# EAGLE schematic v2 Sandwich 8 bit waves (EAGLE 9.0.0)
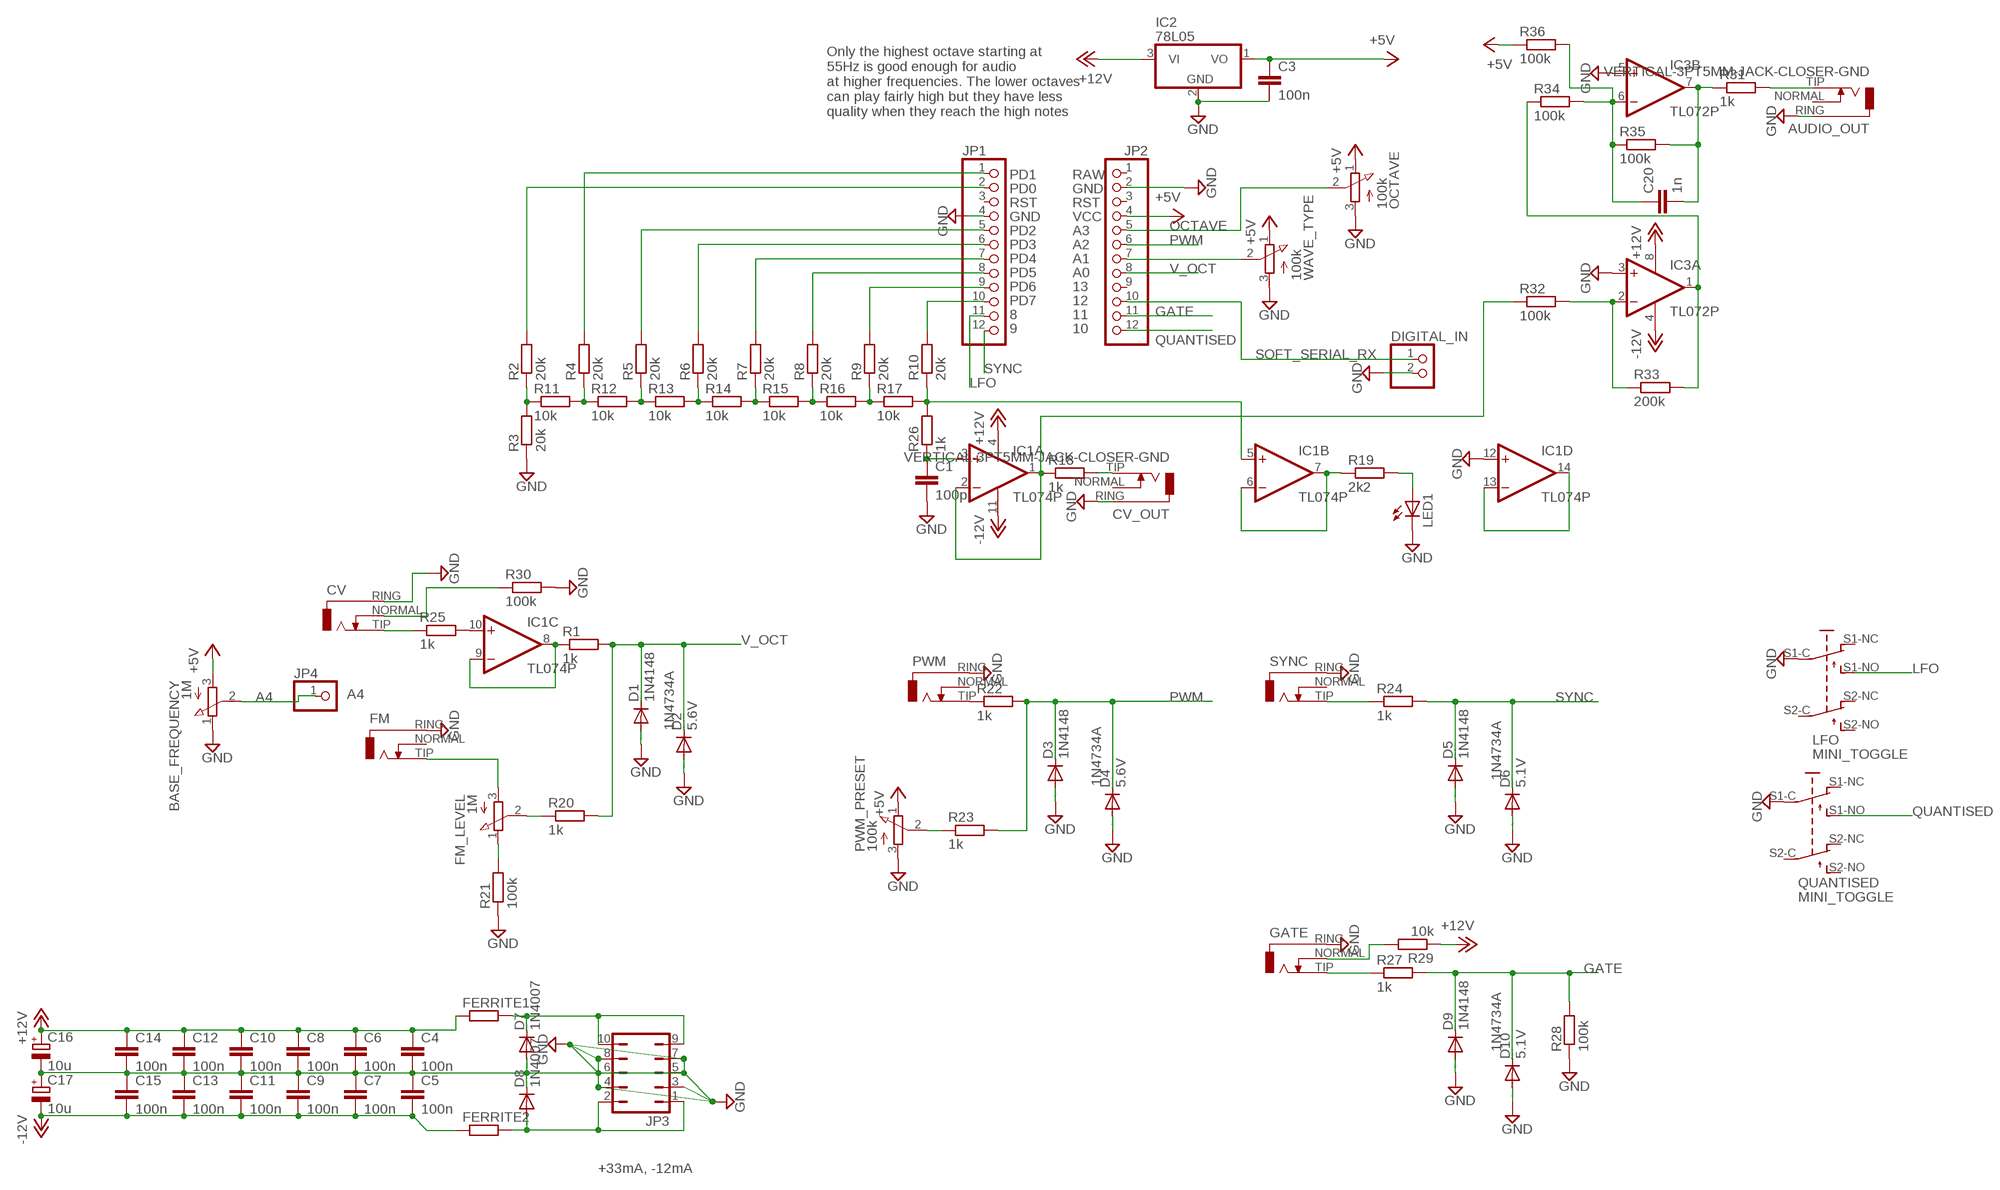
[diagram p0: schematic, sheet 1]

## Parts
AUDIO_OUT  VERTICAL-3PT5MM-JACK-CLOSER-GND  [VERTICAL-3PT5MM-JACK-CLOSER-GND]
BASE_FREQUENCY  1M  9MM_VERT_POT  [EVUF]
C1  100p  C-EU050-024X044  [C050-024X044]
C3  100n  C-EU050-024X044  [C050-024X044]
C4  100n  C-EU050-024X044  [C050-024X044]
C5  100n  C-EU050-024X044  [C050-024X044]
C6  100n  C-EU050-024X044  [C050-024X044]
C7  100n  C-EU050-024X044  [C050-024X044]
C8  100n  C-EU050-024X044  [C050-024X044]
C9  100n  C-EU050-024X044  [C050-024X044]
C10  100n  C-EU050-024X044  [C050-024X044]
C11  100n  C-EU050-024X044  [C050-024X044]
C12  100n  C-EU050-024X044  [C050-024X044]
C13  100n  C-EU050-024X044  [C050-024X044]
C14  100n  C-EU050-024X044  [C050-024X044]
C15  100n  C-EU050-024X044  [C050-024X044]
C16  10u  CPOL-EUE2.5-5  [E2,5-5]
C17  10u  CPOL-EUE2.5-5  [E2,5-5]
C20  1n  C-EU050-024X044  [C050-024X044]
CV  VERTICAL-3PT5MM-JACK-CLOSER-GND  [VERTICAL-3PT5MM-JACK-CLOSER-GND]
CV_OUT  VERTICAL-3PT5MM-JACK-CLOSER-GND  [VERTICAL-3PT5MM-JACK-CLOSER-GND]
D1  1N4148  1N914  [D-6.35]
D2  5.6V  1N4004  [DO41-10]
D3  1N4148  1N914  [D-6.35]
D4  5.6V  1N4004  [DO41-10]
D5  1N4148  1N914  [D-6.35]
D6  5.1V  1N4004  [DO41-10]
D7  1N4007  1N4004  [DO41-10]
D8  1N4007  1N4004  [DO41-10]
D9  1N4148  1N914  [D-6.35]
D10  5.1V  1N4004  [DO41-10]
DIGITAL_IN  PINHD-1X2  [1X02]
FERRITE1  R-EU_0204/7  [0204/7]
FERRITE2  R-EU_0204/7  [0204/7]
FM  VERTICAL-3PT5MM-JACK-CLOSER-GND  [VERTICAL-3PT5MM-JACK-CLOSER-GND]
FM_LEVEL  1M  9MM_VERT_POT  [EVUF]
GATE  VERTICAL-3PT5MM-JACK-CLOSER-GND  [VERTICAL-3PT5MM-JACK-CLOSER-GND]
IC1  TL074P  [DIL14]
IC2  78L05  78L05Z  [TO92]
IC3  TL072P  [DIL08]
JP1  PINHD-1X12  [1X12]
JP2  PINHD-1X12  [1X12]
JP3  JP5Q  [JP5Q]
JP4  PINHD-1X1  [1X01]
LED1  LED3MM-NB  [LED3MM]
LFO  MINI_TOGGLE  [MINI_TOGGLE]
OCTAVE  100k  9MM_VERT_POT  [EVUF]
PWM  VERTICAL-3PT5MM-JACK-CLOSER-GND  [VERTICAL-3PT5MM-JACK-CLOSER-GND]
PWM_PRESET  100k  9MM_VERT_POT  [EVUF]
QUANTISED  MINI_TOGGLE  [MINI_TOGGLE]
R1  1k  R-EU_0204/7  [0204/7]
R2  20k  R-EU_0204/7  [0204/7]
R3  20k  R-EU_0204/7  [0204/7]
R4  20k  R-EU_0204/7  [0204/7]
R5  20k  R-EU_0204/7  [0204/7]
R6  20k  R-EU_0204/7  [0204/7]
R7  20k  R-EU_0204/7  [0204/7]
R8  20k  R-EU_0204/7  [0204/7]
R9  20k  R-EU_0204/7  [0204/7]
R10  20k  R-EU_0204/7  [0204/7]
R11  10k  R-EU_0204/7  [0204/7]
R12  10k  R-EU_0204/7  [0204/7]
R13  10k  R-EU_0204/7  [0204/7]
R14  10k  R-EU_0204/7  [0204/7]
R15  10k  R-EU_0204/7  [0204/7]
R16  10k  R-EU_0204/7  [0204/7]
R17  10k  R-EU_0204/7  [0204/7]
R18  1k  R-EU_0204/7  [0204/7]
R19  2k2  R-EU_0204/7  [0204/7]
R20  1k  R-EU_0204/7  [0204/7]
R21  100k  R-EU_0204/7  [0204/7]
R22  1k  R-EU_0204/7  [0204/7]
R23  1k  R-EU_0204/7  [0204/7]
R24  1k  R-EU_0204/7  [0204/7]
R25  1k  R-EU_0204/7  [0204/7]
R26  1k  R-EU_0204/7  [0204/7]
R27  1k  R-EU_0204/7  [0204/7]
R28  100k  R-EU_0204/7  [0204/7]
R29  10k  R-EU_0204/7  [0204/7]
R30  100k  R-EU_0204/7  [0204/7]
R31  1k  R-EU_0204/7  [0204/7]
R32  100k  R-EU_0204/7  [0204/7]
R33  200k  R-EU_0204/7  [0204/7]
R34  100k  R-EU_0204/7  [0204/7]
R35  100k  R-EU_0204/7  [0204/7]
R36  100k  R-EU_0204/7  [0204/7]
SYNC  VERTICAL-3PT5MM-JACK-CLOSER-GND  [VERTICAL-3PT5MM-JACK-CLOSER-GND]
WAVE_TYPE  100k  9MM_VERT_POT  [EVUF]

## Nets
+5V [power]: BASE_FREQUENCY.3(A) C3.1 IC2.1(VO) JP2.4 OCTAVE.1(E) PWM_PRESET.1(E) R36.1 WAVE_TYPE.1(E)
+12V [power]: C4.1 C6.1 C8.1 C10.1 C12.1 C14.1 C16.+ FERRITE1.1 IC1.4(P:V+) IC2.3(VI) IC3.8(P:V+) R29.1
-12V [power]: C5.2 C7.2 C9.2 C11.2 C13.2 C15.2 C17.- FERRITE2.1 IC1.11(P:V-) IC3.4(P:V-)
A4: BASE_FREQUENCY.2(S) JP4.1
GATE: D9.C D10.C JP2.11 R27.2 R28.2
GND: AUDIO_OUT.RING BASE_FREQUENCY.1(E) C1.2 C3.2 C4.2 C5.1 C6.2 C7.1 C8.2 C9.1 C10.2 C11.1 C12.2 C13.1 C14.2 C15.1 C16.- C17.+ CV.RING CV_OUT.RING D1.A D2.A D3.A D4.A D5.A D6.A D7.A D8.C D9.A D10.A DIGITAL_IN.2 FM.RING GATE.RING IC1.12(D:+IN) IC2.2(GND) IC3.3(A:+IN) IC3.5(B:+IN) JP1.4 JP2.2 JP3.3 JP3.4 JP3.5 JP3.6 JP3.7 JP3.8 LED1.K(C) LFO.S1-C OCTAVE.3(A) PWM.RING PWM_PRESET.3(A) QUANTISED.S1-C R3.1 R21.1 R28.1 R30.2 SYNC.RING WAVE_TYPE.3(A)
LFO: JP1.11 LFO.S1-NO
N$1: R2.1 R3.2 R11.1
N$2: R4.1 R11.2 R12.1
N$3: R5.1 R12.2 R13.1
N$4: R6.1 R13.2 R14.1
N$5: R7.1 R14.2 R15.1
N$6: R8.1 R15.2 R16.1
N$7: R9.1 R16.2 R17.1
N$8: IC1.5(B:+IN) R10.1 R17.2 R26.2
N$9: JP1.2 R2.2
N$10: JP1.1 R4.2
N$11: JP1.5 R5.2
N$12: JP1.6 R6.2
N$13: JP1.7 R7.2
N$14: JP1.8 R8.2
N$15: JP1.9 R9.2
N$16: JP1.10 R10.2
N$17: IC1.1(A:OUT) IC1.2(A:-IN) R18.1 R32.1
N$18: IC1.6(B:-IN) IC1.7(B:OUT) R19.1
N$19: CV_OUT.TIP R18.2
N$20: LED1.A R19.2
N$21: IC1.8(C:OUT) IC1.9(C:-IN) R1.1
N$22 [power]: D7.C FERRITE1.2 JP3.9 JP3.10
N$23: FM_LEVEL.1(E) R21.2
N$24: FM.TIP FM_LEVEL.3(A)
N$25 [power]: D8.A FERRITE2.2 JP3.1 JP3.2
N$26: FM_LEVEL.2(S) R20.1
N$27: JP2.7 WAVE_TYPE.2(S)
N$28: PWM.TIP R22.1
N$29: R24.1 SYNC.TIP
N$30: PWM_PRESET.2(S) R23.1
N$31: CV.TIP R25.1
N$32: IC1.10(C:+IN) R25.2
N$33: IC1.13(D:-IN) IC1.14(D:OUT)
N$34: C1.1 IC1.3(A:+IN) R26.1
N$35: GATE.TIP R27.1
N$36: GATE.NORMAL R29.2
N$37: CV.NORMAL R30.1
N$38: C20.2 IC3.7(B:OUT) R31.1 R35.2
N$39: AUDIO_OUT.TIP R31.2
N$40: IC3.2(A:-IN) R32.2 R33.1
N$41: IC3.1(A:OUT) R33.2 R34.1
N$42: C20.1 IC3.6(B:-IN) R34.2 R35.1 R36.2
OCTAVE: JP2.5 OCTAVE.2(S)
PWM: D3.C D4.C JP2.6 R22.2 R23.2
QUANTISED: JP2.12 QUANTISED.S1-NO
SOFT_SERIAL_RX: DIGITAL_IN.1 JP2.10
SYNC: D5.C D6.C JP1.12 R24.2
V_OCT: D1.C D2.C JP2.8 R1.2 R20.2
Unconnected: AUDIO_OUT.NORMAL CV_OUT.NORMAL FM.NORMAL JP1.3 JP2.1 JP2.3 JP2.9 LFO.S1-NC LFO.S2-C LFO.S2-NC LFO.S2-NO PWM.NORMAL QUANTISED.S1-NC QUANTISED.S2-C QUANTISED.S2-NC QUANTISED.S2-NO SYNC.NORMAL

## Notes on the sheet
- Only the highest octave starting at
  55Hz is good enough for audio
  at higher frequencies. The lower octaves
  can play fairly high but they have less
  quality when they reach the high notes
- PD1
  PD0
  RST
  GND
  PD2
  PD3
  PD4
  PD5
  PD6
  PD7
  8
  9
- RAW
  GND
  RST
  VCC
  A3
  A2
  A1
  A0
  13
  12
  11
  10
- A4
- 1N4734A
- 1N4734A
- 1N4734A
- 1N4734A
- +33mA, -12mA

## Library data of the parts
AUDIO_OUT CV CV_OUT FM GATE PWM SYNC = vertical-3pt5mm-jack:VERTICAL-3PT5MM-JACK-CLOSER-GND
BASE_FREQUENCY FM_LEVEL OCTAVE PWM_PRESET WAVE_TYPE = toggle-nb:9MM_VERT_POT
C1 C3-C15 C20 = rcl:C-EU: CAPACITOR, European symbol; SPICEPREFIX: C
C16 C17 = rcl:CPOL-EU: POLARIZED CAPACITOR, European symbol; SPICEPREFIX: C
D1 D3 D5 D9 = toggle-nb:1N914
D2 D4 D6-D8 D10 = diode:1N4004: DIODE general purpose rectifier, 1 A
DIGITAL_IN = pinhead:PINHD-1X2: PIN HEADER
FERRITE1 FERRITE2 R1-R36 = rcl:R-EU_: RESISTOR, European symbol; SPICEPREFIX: R
IC1 = linear:TL074: OP AMP
IC2 = linear:78*: Positive VOLTAGE REGULATOR Source: http://cache.national.com/ds/LM/LM78L05.pdf http://www.fairchildsemi.com/ds/LM/LM7805.pdf
IC3 = linear:TL072: OP AMP
JP1 JP2 = pinhead:PINHD-1X12: PIN HEADER
JP3 = jumper:JP5Q: JUMPER
JP4 = pinhead:PINHD-1X1: PIN HEADER
LED1 = toggle-nb:LED3MM-NB
LFO QUANTISED = toggle-nb:MINI_TOGGLE

## Net classes
0 default: width 0.457 mm, clearance 0.152 mm
1 power: width 0.559 mm, clearance 0.152 mm